# EAGLE design fms controller (EAGLE 9.0.1)
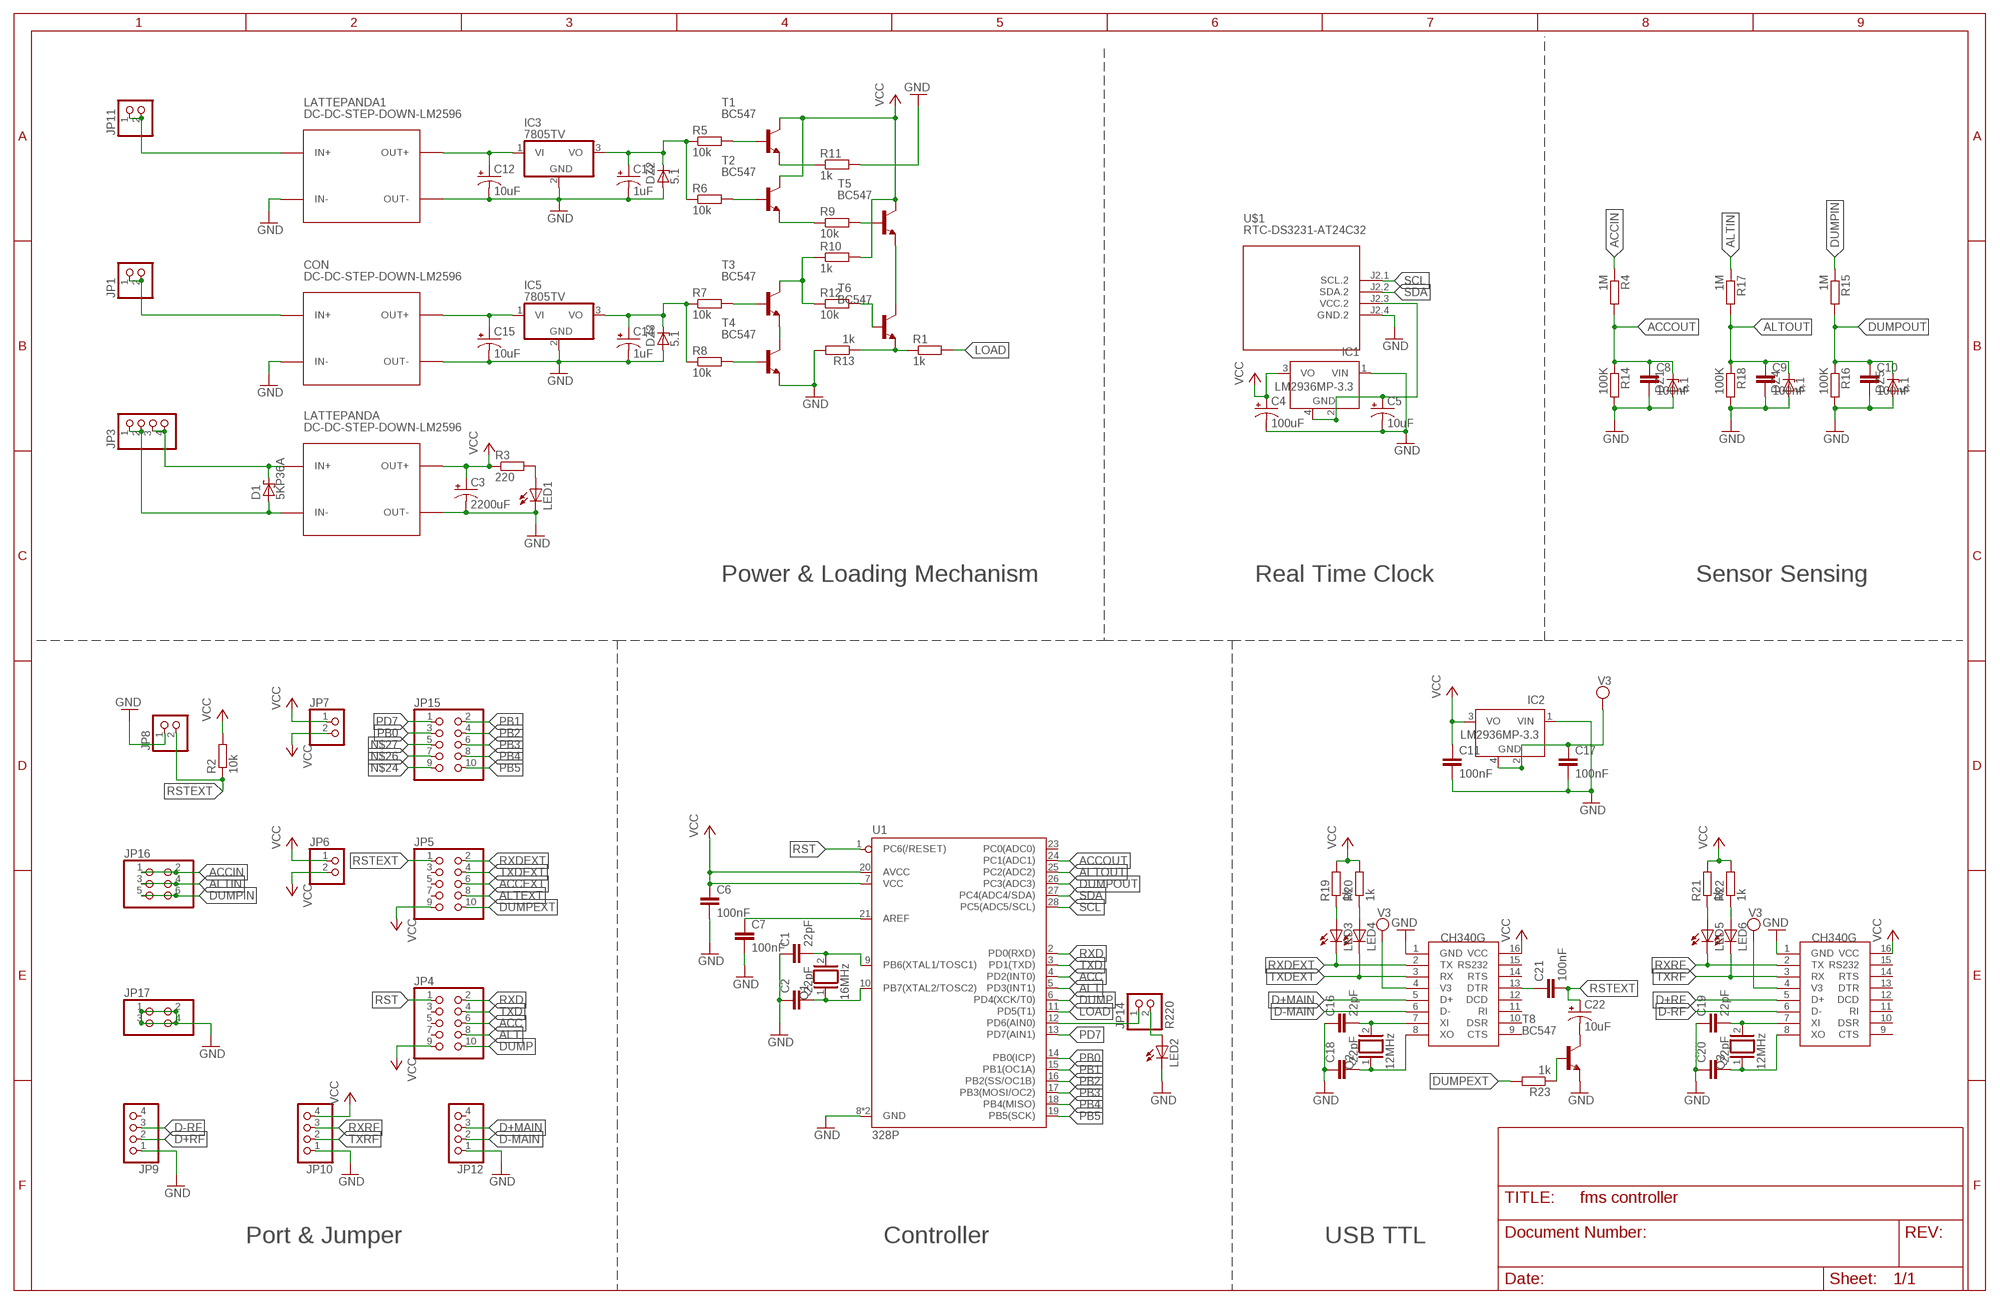
[diagram p0: schematic, sheet 1]

## Parts
C1  22pF  C2,5-3  [C2.5-3]
C2  22pF  C2,5-3  [C2.5-3]
C3  2200uF  CPOL-USE5-13  [E5-13]
C4  100uF  CPOL-USE2-5  [E2-5]
C5  10uF  CPOL-USE2-5  [E2-5]
C6  100nF  C-EU025-040X050  [C025-040X050]
C7  100nF  C-EU025-040X050  [C025-040X050]
C8  100nF  C-EU025-040X050  [C025-040X050]
C9  100nF  C-EU025-040X050  [C025-040X050]
C10  100nF  C-EU025-040X050  [C025-040X050]
C11  100nF  C-EU025-040X050  [C025-040X050]
C12  10uF  CPOL-USE2-5  [E2-5]
C13  1uF  CPOL-USE2-5  [E2-5]
C14  1uF  CPOL-USE2-5  [E2-5]
C15  10uF  CPOL-USE2-5  [E2-5]
C16  22pF  C2,5-3  [C2.5-3]
C17  100nF  C-EU025-040X050  [C025-040X050]
C18  22pF  C2,5-3  [C2.5-3]
C19  22pF  C2,5-3  [C2.5-3]
C20  22pF  C2,5-3  [C2.5-3]
C21  100nF  C-EU025-040X050  [C025-040X050]
C22  10uF  CPOL-USE2-5  [E2-5]
CON  DC-DC-STEP-DOWN-LM2596  [DC-DC-STEP-DOWN-LM2596]
D1  5KP36A  5KPXX  [P6T15]
DZ1  5.1  ZPD  [DO35Z10]
DZ2  5.1  ZPD  [DO35Z10]
DZ3  5.1  ZPD  [DO35Z10]
DZ4  5.1  ZPD  [DO35Z10]
DZ5  5.1  ZPD  [DO35Z10]
IC1  LM2936MP-3.3  [SOT223]
IC2  LM2936MP-3.3  [SOT223]
IC3  7805TV  [TO220V]
IC5  7805TV  [TO220V]
JP1  PINHD-1X2  [1X02]
JP3  PINHD-1X4  [1X04]
JP4  PINHD-2X5  [2X05]
JP5  PINHD-2X5  [2X05]
JP6  PINHD-1X2  [1X02]
JP7  PINHD-1X2  [1X02]
JP8  PINHD-1X2  [1X02]
JP9  PINHD-1X4  [1X04]
JP10  PINHD-1X4  [1X04]
JP11  PINHD-1X2  [1X02]
JP12  PINHD-1X4  [1X04]
JP14  R220  PINHD-1X2  [1X02]
JP15  PINHD-2X5  [2X05]
JP16  PINHD-2X3  [2X03]
JP17  PINHD-2X2  [2X02]
LATTEPANDA  DC-DC-STEP-DOWN-LM2596  [DC-DC-STEP-DOWN-LM2596]
LATTEPANDA1  DC-DC-STEP-DOWN-LM2596  [DC-DC-STEP-DOWN-LM2596]
LED1  LED3MM  [LED3MM]
LED2  LED3MM  [LED3MM]
LED3  LED3MM  [LED3MM]
LED4  LED3MM  [LED3MM]
LED5  LED3MM  [LED3MM]
LED6  LED3MM  [LED3MM]
Q1  16MHz  XTAL/S  [QS]
Q2  12MHz  XTAL/S  [QS]
Q3  12MHz  XTAL/S  [QS]
R1  1k  R-EU_0309/10  [0309/10]
R2  10k  R-EU_0309/10  [0309/10]
R3  220  R-EU_0309/10  [0309/10]
R4  1M  R-EU_0309/10  [0309/10]
R5  10k  R-EU_0309/10  [0309/10]
R6  10k  R-EU_0309/10  [0309/10]
R7  10k  R-EU_0309/10  [0309/10]
R8  10k  R-EU_0309/10  [0309/10]
R9  10k  R-EU_0309/10  [0309/10]
R10  1k  R-EU_0309/10  [0309/10]
R11  1k  R-EU_0309/10  [0309/10]
R12  10k  R-EU_0309/10  [0309/10]
R13  1k  R-EU_0309/10  [0309/10]
R14  100K  R-EU_0309/10  [0309/10]
R15  1M  R-EU_0309/10  [0309/10]
R16  100K  R-EU_0309/10  [0309/10]
R17  1M  R-EU_0309/10  [0309/10]
R18  100K  R-EU_0309/10  [0309/10]
R19  1k  R-EU_0309/10  [0309/10]
R20  1k  R-EU_0309/10  [0309/10]
R21  1k  R-EU_0309/10  [0309/10]
R22  1k  R-EU_0309/10  [0309/10]
R23  1k  R-EU_0309/10  [0309/10]
T1  BC547  [TO92]
T2  BC547  [TO92]
T3  BC547  [TO92]
T4  BC547  [TO92]
T5  BC547  [TO92]
T6  BC547  [TO92]
T8  BC547  [TO92]
U1  328P  ATMEGA328P_PDIP  [DIP28]
U$1  RTC-DS3231-AT24C32  [RTC-DS3231-AT24C32]
U$2  CH340G  [SOIC16]
U$3  CH340G  [SOIC16]

## Nets
ACC: JP4.6 U1.4(PD2(INT0))
ACCEXT: JP5.6
ACCIN: JP16.1 JP16.2 R4.1
ACCOUT: C8.1 DZ1.C R4.2 R14.1 U1.24(PC1(ADC1))
ALT: JP4.8 U1.5(PD3(INT1))
ALTEXT: JP5.8
ALTIN: JP16.3 JP16.4 R17.1
ALTOUT: C9.1 DZ4.C R17.2 R18.1 U1.25(PC2(ADC2))
D+MAIN: JP12.3 U$2.5(D+)
D+RF: JP9.2 U$3.5(D+)
D-MAIN: JP12.2 U$2.6(D-)
D-RF: JP9.3 U$3.6(D-)
DUMP: JP4.10 U1.6(PD4(XCK/T0))
DUMPEXT: JP5.10 R23.2
DUMPIN: JP16.5 JP16.6 R15.1
DUMPOUT: C10.1 DZ5.C R15.2 R16.1 U1.26(PC3(ADC3))
GND: C1.1 C2.1 C3.- C4.- C5.- C6.2 C7.2 C8.2 C9.2 C10.2 C11.2 C12.- C13.- C14.- C15.- C16.1 C17.2 C18.1 C19.1 C20.1 CON.IN- CON.OUT- DZ1.A DZ2.A DZ3.A DZ4.A DZ5.A IC1.1(VIN) IC2.1(VIN) IC3.2(GND) IC5.2(GND) JP8.1 JP9.1 JP10.1 JP12.1 JP17.1 JP17.2 JP17.3 JP17.4 LATTEPANDA1.IN- LATTEPANDA1.OUT- LATTEPANDA.OUT- LED1.K(C) LED2.K(C) R11.2 R13.2 R14.2 R16.2 R18.2 T4.1(E) T8.1(E) U1.8(GND) U1.22(GND) U$1.J2.4(GND.2) U$2.1(GND) U$3.1(GND)
LOAD: R1.2 U1.11(PD5(T1))
N$1: JP11.1 JP11.2 LATTEPANDA1.IN+
N$3: CON.IN+ JP1.1 JP1.2
N$5: LED1.A R3.2
N$7: D1.A JP3.1 JP3.2 LATTEPANDA.IN-
N$8: D1.C JP3.3 JP3.4 LATTEPANDA.IN+
N$9: C12.+ IC3.1(VI) LATTEPANDA1.OUT+
N$10: C1.2 Q1.2 U1.9(PB6(XTAL1/TOSC1))
N$11: JP14.1 U1.12(PD6(AIN0))
N$12: C13.+ DZ2.C IC3.3(VO) R5.1 R6.1
N$13: R1.1 R13.1 T6.1(E)
N$14: C15.+ CON.OUT+ IC5.1(VI)
N$15: C2.2 Q1.1 U1.10(PB7(XTAL2/TOSC2))
N$16: C14.+ DZ3.C IC5.3(VO) R7.1 R8.1
N$17: JP14.2 LED2.A
N$18: C5.+ IC1.2(GND) IC1.4(GND) U$1.J2.3(VCC.2)
N$19: C7.1 U1.21(AREF)
N$20: C19.2 Q3.2 U$3.7(XI)
N$21: R11.1 T1.1(E)
N$22: C20.2 Q3.1 U$3.8(XO)
N$23: C16.2 Q2.2 U$2.7(XI)
N$24: JP15.9
N$25: R5.2 T1.2(B)
N$26: JP15.7
N$27: JP15.5
N$28: C18.2 Q2.1 U$2.8(XO)
N$29: R10.1 R12.1 T3.3(C)
N$30: R6.2 T2.2(B)
N$31: C21.1 U$2.13(DTR)
N$32: R7.2 T3.2(B)
N$33: C22.- T8.3(C)
N$34: R9.1 T2.1(E)
N$35: R9.2 T5.2(B)
N$36: R8.2 T4.2(B)
N$37: LED4.A R20.1
N$38: T3.1(E) T4.3(C)
N$39: LED3.A R19.1
N$40: R12.2 T6.2(B)
N$41: T5.1(E) T6.3(C)
N$42: LED5.A R21.1
N$43: LED6.A R22.1
N$44: R23.1 T8.2(B)
PB0: JP15.3 U1.14(PB0(ICP))
PB1: JP15.2 U1.15(PB1(OC1A))
PB2: JP15.4 U1.16(PB2(SS/OC1B))
PB3: JP15.6 U1.17(PB3(MOSI/OC2))
PB4: JP15.8 U1.18(PB4(MISO))
PB5: JP15.10 U1.19(PB5(SCK))
PD7: JP15.1 U1.13(PD7(AIN1))
RST: JP4.1 U1.1(PC6(/RESET))
RSTEXT: C21.2 C22.+ JP5.1 JP8.2 R2.1
RXD: JP4.2 U1.2(PD0(RXD))
RXDEXT: JP5.2 LED3.K(C) U$2.2(TX)
RXRF: JP10.3 LED5.K(C) U$3.2(TX)
SCL: U1.28(PC5(ADC5/SCL)) U$1.J2.1(SCL.2)
SDA: U1.27(PC4(ADC4/SDA)) U$1.J2.2(SDA.2)
TXD: JP4.4 U1.3(PD1(TXD))
TXDEXT: JP5.4 LED4.K(C) U$2.3(RX)
TXRF: JP10.2 LED6.K(C) U$3.3(RX)
VCC: C3.+ C4.+ C6.1 C11.1 IC1.3(VO) IC2.3(VO) JP4.9 JP5.9 JP6.1 JP6.2 JP7.1 JP7.2 JP10.4 LATTEPANDA.OUT+ R2.2 R3.1 R10.2 R19.2 R20.2 R21.2 R22.2 T1.3(C) T2.3(C) T5.3(C) U1.7(VCC) U1.20(AVCC) U$2.16(VCC) U$3.16(VCC)
VSS: C17.1 IC2.2(GND) IC2.4(GND) U$2.4(V3) U$3.4(V3) ; supply symbol labelled V3
Unconnected: JP4.3 JP4.5 JP4.7 JP5.3 JP5.5 JP5.7 JP9.4 JP12.4 U1.23(PC0(ADC0)) U$2.9(CTS) U$2.10(DSR) U$2.11(RI) U$2.12(DCD) U$2.14(RTS) U$2.15(RS232) U$3.9(CTS) U$3.10(DSR) U$3.11(RI) U$3.12(DCD) U$3.13(DTR) U$3.14(RTS) U$3.15(RS232)

## Notes on the sheet
- Power & Loading Mechanism | Real Time Clock | Sensor Sensing
- Port & Jumper | Controller | USB TTL

## Library data of the parts
C1 C2 C16 C18-C20 = capacitor-wima:C: CAPACITOR naming: grid - package width
C3-C5 C12-C15 C22 = rcl:CPOL-US: POLARIZED CAPACITOR, American symbol; SPICEPREFIX: C
C6-C11 C17 C21 = rcl:C-EU: CAPACITOR, European symbol; SPICEPREFIX: C
CON LATTEPANDA LATTEPANDA1 = diy-modules:DC-DC-STEP-DOWN-LM2596: DC/DC Step-Down Regulator based on LM2596-ADJ chip LM2596 datasheet available here: http://www.ti.com/lit/ds/symlink/lm2596.pdf Click here to find device on ebay.com <http://www.ebay.com/sch/lm2596+power+regulator>
D1 = diode:5KPXX: DIODE transient voltage suppressor
DZ1-DZ5 = diode:ZPD: Z DIODE 500 mW
IC1 IC2 = national-semiconductor:LM2936MP?*: Ultra-Low Quiescent Current LDO Voltage Regulator Source: Data sheet <http://www.national.com/ds/LM/LM2936.pdf>; MF: NATIONAL SEMICONDUCTOR; MPN: LM2936MP-3.3/NOPB; OC_FARNELL: 1469062; OC_NEWARK: 41K4523
IC3 IC5 = linear:78*: Positive VOLTAGE REGULATOR Source: http://cache.national.com/ds/LM/LM78L05.pdf http://www.fairchildsemi.com/ds/LM/LM7805.pdf
JP1 JP6-JP8 JP11 JP14 = pinhead:PINHD-1X2: PIN HEADER
JP3 JP9 JP10 JP12 = pinhead:PINHD-1X4: PIN HEADER
JP4 JP5 JP15 = pinhead:PINHD-2X5: PIN HEADER
JP16 = pinhead:PINHD-2X3: PIN HEADER
JP17 = pinhead:PINHD-2X2: PIN HEADER
LED1-LED6 = led:LED: LED OSRAM: - CHIPLED LG R971, LG N971, LY N971, LG Q971, LY Q971, LO R971, LY R971 LH N974, LH R974 LS Q976, LO Q976, LY Q976 LO Q996 - Hyper CHIPLED LW Q18S LB Q993, LB Q99A, LB R99A - SideLED LS A670, LO A670, LY A670, LG A670, LP A670 LB A673, LV A673, LT A673, LW A673 LH A674 LY A675 LS A676, LA A676, LO A676, LY A676, LW A676 LS A679, LY A679, LG A679 - Hyper Micro SIDELED® LS Y876, LA Y876, LO Y876, LY Y876 LT Y87S - SmartLED LW L88C, LW L88S LB L89C, LB L89S, LG L890 LS L89K, LO L89K, LY L89K LS L896, LA L896, LO L896, LY L896 - TOPLED LS T670, LO T670, LY T670, LG T670, LP T670 LSG T670, LSP T670, LSY T670, LOP T670, LYG T670 LG T671, LOG T671, LSG T671 LB T673, LV T673, LT T673, LW T673 LH T674 LS T676, LA T676, LO T676, LY T676, LB T676, LH T676, LSB T676, LW T676 LB T67C, LV T67C, LT T67C, LS T67K, LO T67K, LY T67K, LW E67C LS E67B, LA E67B, LO E67B, LY E67B, LB E67C, LV E67C, LT E67C LW T67C LS T679, LY T679, LG T679 LS T770, LO T770, LY T770, LG T770, LP T770 LB T773, LV T773, LT T773, LW T773 LH T774 LS E675, LA E675, LY E675, LS T675 LS T776, LA T776, LO T776, LY T776, LB T776 LHGB T686 LT T68C, LB T68C - Hyper Mini TOPLED® LB M676 - Mini TOPLED Santana® LG M470 LS M47K, LO M47K, LY M47K Source: http://www.osram.convergy.de LUXEON: - LUMILED® LXK2-PW12-R00, LXK2-PW12-S00, LXK2-PW14-U00, LXK2-PW14-V00 LXK2-PM12-R00, LXK2-PM12-S00, LXK2-PM14-U00 LXK2-PE12-Q00, LXK2-PE12-R00, LXK2-PE12-S00, LXK2-PE14-T00, LXK2-PE14-U00 LXK2-PB12-K00, LXK2-PB12-L00, LXK2-PB12-M00, LXK2-PB14-N00, LXK2-PB14-P00, LXK2-PB14-Q00 LXK2-PR12-L00, LXK2-PR12-M00, LXK2-PR14-Q00, LXK2-PR14-R00 LXK2-PD12-Q00, LXK2-PD12-R00, LXK2-PD12-S00 LXK2-PH12-R00, LXK2-PH12-S00 LXK2-PL12-P00, LXK2-PL12-Q00, LXK2-PL12-R00 Source: www.luxeon.com KINGBRIGHT: KA-3528ASYC Source: www.kingbright.com
Q1-Q3 = special:XTAL/S: CRYSTAL
R1-R23 = rcl:R-EU_: RESISTOR, European symbol; SPICEPREFIX: R
T1-T6 T8 = transistor:BC547: NPN TRANSISTOR
U1 = SparkFun-IC-Microcontroller:ATMEGA328P_PDIP: Atmel 328P Through hole ATMEGA328P uC used in the Arduino 32kb flash, 1k EEPROM, 2k SRAM Datasheet <http://www.sparkfun.com/datasheets/Components/SMD/ATMega328.pdf> SparkFun Products Storefront component: AVR 28 Pin 20MHz 32K 6A/D - ATMega328P <https://www.sparkfun.com/products/9061> (COM-09061) SparkFun Simon Says - Through-Hole Soldering Kit <https://www.sparkfun.com/products/10547> (KIT-10547) SparkFun Learn to Solder - Simon Says <https://www.sparkfun.com/products/13708> (KIT-13708) SparkFun BigTime Watch Kit <https://www.sparkfun.com/products/11734> (KIT-11734) SparkFun ClockIt <https://www.sparkfun.com/products/10930> (KIT-10930) SparkFun Serial Enabled LCD Kit <https://www.sparkfun.com/products/10097> (LCD-10097) SparkFun Simon Tilts - Through Hole Soldering Kit <https://www.sparkfun.com/products/12634> (KIT-12634) SparkFun Frequency Counter Kit <https://www.sparkfun.com/products/10140> (KIT-10140) FabFM Radio Kit <https://www.sparkfun.com/products/11043> (KIT-11043) SparkFun Binary Blaster Kit <https://www.sparkfun.com/products/12037> (KIT-12037) SparkFun Metro-Gnome <https://www.sparkfun.com/products/9236> (KIT-09236) ATmega328 with Arduino Optiboot (Uno) <https://www.sparkfun.com/products/10524> (DEV-10524); PROD_ID: IC-09136
U$1 = diy-modules:RTC-DS3231-AT24C32: RTC Module with Battery and EEPROM based on DS3231 and AT24C32 chips Tutorial can be found here: https://edwardmallon.wordpress.com/2014/05/21/using-a-cheap-3-ds3231-rtc-at24c32-eeprom-from-ebay/ Click here to find device on ebay.com <http://www.ebay.com/sch/DS3231+AT24C32+module>
U$2 U$3 = ch340g:CH340G

## Board
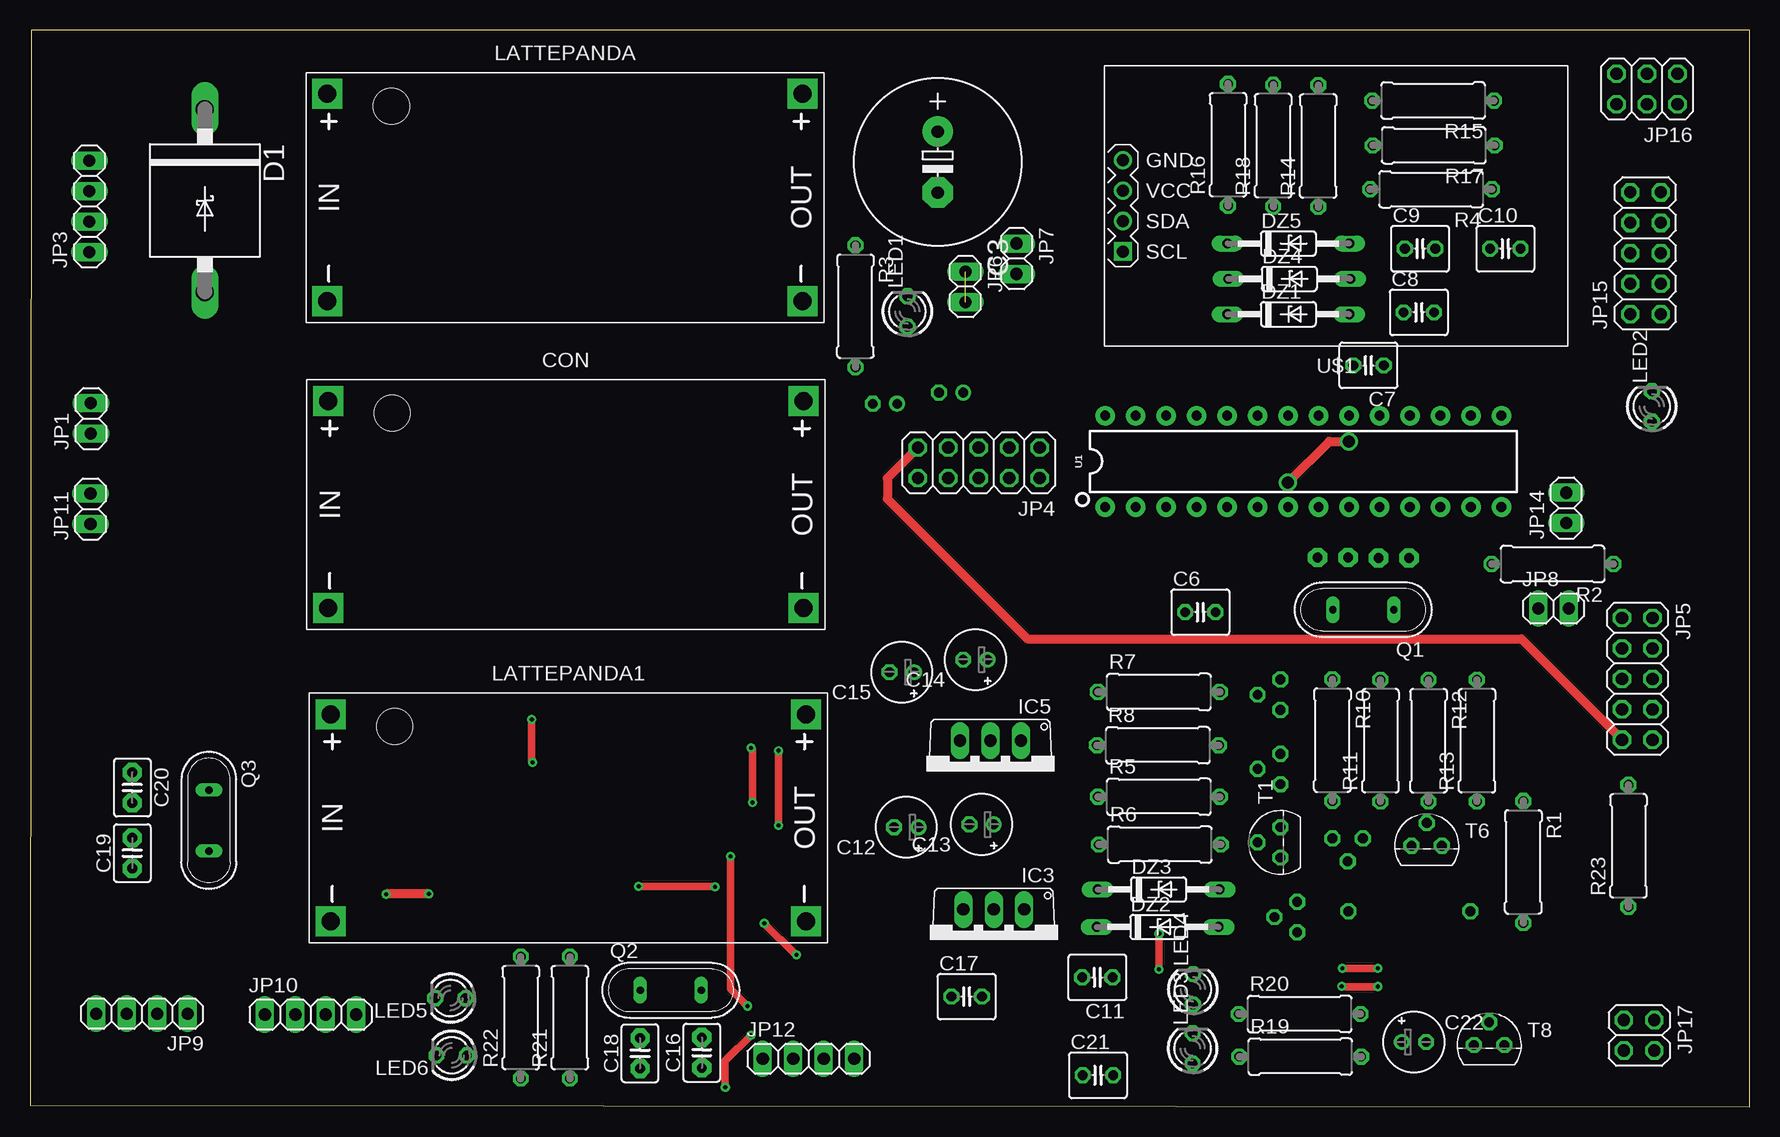
[diagram p1: board, top side]
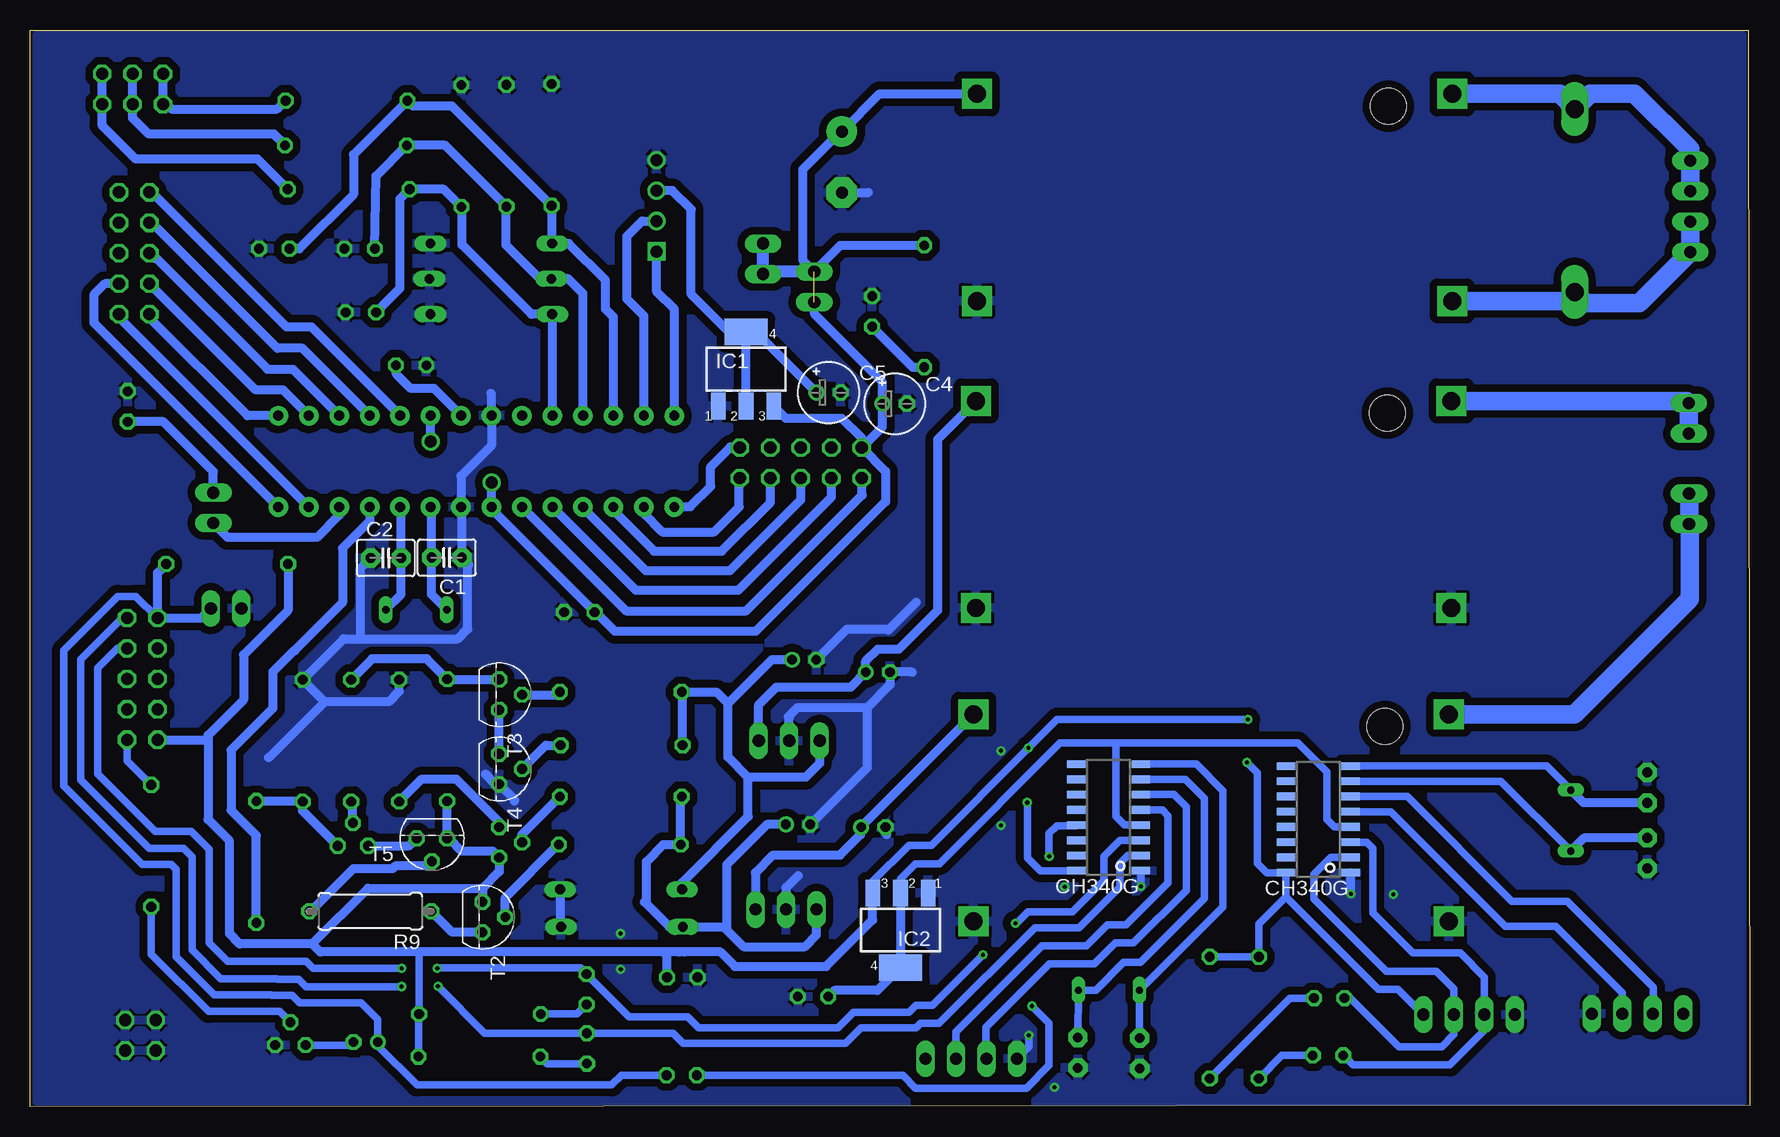
[diagram p2: board, bottom side, seen from below]

Size 143.34 x 89.78 mm. Coordinates in mm from the lower left corner, seen from the top.
Outline: 0,0.13 143.34,0 143.34,89.75 0.1,89.78 0,0.13
Copper layers (1*16): Top 0.035mm / dielectric 1.5mm / Bottom 0.035mm
Design rules "default *": minimum track width 30mil, minimum drill 1mm, track to track 8mil, track to pad 8mil, pad to pad 8mil, via to via 8mil, smd to smd 8mil, copper to edge 0mil, drill to drill 10mil, minimum pad ring 10mil, minimum via ring 8mil, stop-mask expansion 4mil, vias tented up to drill 0mil, thermal gap 10mil

### Footprints (pad centres in the part's own frame; a part is rotated, then mirrored left to right if it is on the bottom)
C2.5-3 = drill 0.813 pad 1.6 octagon: 1 -1.27,0; 2 1.27,0
E5-13 = drill 1.016 pad 2.54: + -2.54,0 | drill 1.016 pad 2.54 octagon: - 2.54,0
E2-5 = drill 0.813 pad 1.27: + -1.016,0 | drill 0.813 pad 1.27 octagon: - 1.016,0
C025-040X050 = drill 0.813 octagon: 1 -1.27,0; 2 1.27,0
DC-DC-STEP-DOWN-LM2596 = drill 1.5 pad 2.5 square: IN+ -19.812,8.636; IN- -19.812,-8.636; OUT+ 19.812,8.636; OUT- 19.812,-8.636 | hole 3: -14.478,7.62
P6T15 = drill 1.499 long: A 7.62,0; C -7.62,0
DO35Z10 = drill 0.813 long: A 5.08,0; C -5.08,0
SOT223 = smd 1.219 x 2.235: 1 -2.311,-3.099; 2 0,-3.099; 3 2.311,-3.099 | smd 3.6 x 2.2: 4 0,3.099
TO220V = drill 1.016 long: 1 -2.54,-2.54; 2 0,-2.54; 3 2.54,-2.54
1X02 = drill 1.016 long: 1 -1.27,0; 2 1.27,0
1X04 = drill 1.016 long: 1 -3.81,0; 2 -1.27,0; 3 1.27,0; 4 3.81,0
2X05 = drill 1.016 octagon: 1 -5.08,-1.27; 2 -5.08,1.27; 3 -2.54,-1.27; 4 -2.54,1.27; 5 0,-1.27; 6 0,1.27; 7 2.54,-1.27; 8 2.54,1.27; 9 5.08,-1.27; 10 5.08,1.27
2X03 = drill 1.016 octagon: 1 -2.54,-1.27; 2 -2.54,1.27; 3 0,-1.27; 4 0,1.27; 5 2.54,-1.27; 6 2.54,1.27
2X02 = drill 1.016 octagon: 1 -1.27,-1.27; 2 -1.27,1.27; 3 1.27,-1.27; 4 1.27,1.27
LED3MM = drill 0.813 octagon: A -1.27,0; K 1.27,0
QS = drill 0.61 long: 1 -2.54,0; 2 2.54,0
0309/10 = drill 0.813 octagon: 1 -5.08,0; 2 5.08,0
TO92 = drill 0.813 octagon: 1 1.27,0; 2 0,1.905; 3 -1.27,0
DIP28 = drill 0.813 pad 1.626: 1 -16.51,-3.81; 2 -13.97,-3.81; 3 -11.43,-3.81; 4 -8.89,-3.81; 5 -6.35,-3.81; 6 -3.81,-3.81; 7 -1.27,-3.81; 8 1.27,-3.81; 9 3.81,-3.81; 10 6.35,-3.81; 11 8.89,-3.81; 12 11.43,-3.81; 13 13.97,-3.81; 14 16.51,-3.81; 15 16.51,3.81; 16 13.97,3.81; 17 11.43,3.81; 18 8.89,3.81; 19 6.35,3.81; 20 3.81,3.81; 21 1.27,3.81; 22 -1.27,3.81; 23 -3.81,3.81; 24 -6.35,3.81; 25 -8.89,3.81; 26 -11.43,3.81; 27 -13.97,3.81; 28 -16.51,3.81
RTC-DS3231-AT24C32 = drill 1 square: J2.1 17.78,3.81 | drill 1: J2.2 17.78,1.27; J2.3 17.78,-1.27; J2.4 17.78,-3.81
SOIC16 = smd 0.635 x 1.524: 1 -4.445,-2.695; 2 -3.175,-2.695; 3 -1.905,-2.695; 4 -0.635,-2.695; 5 0.635,-2.695; 6 1.905,-2.695; 7 3.175,-2.695; 8 4.445,-2.695; 9 4.445,2.695; 10 3.175,2.695; 11 1.905,2.695; 12 0.635,2.695; 13 -0.635,2.695; 14 -1.905,2.695; 15 -3.175,2.695; 16 -4.445,2.695

### Placement (x,y rotation side)
C1  108.6,45.79 180 bottom
C2  113.68,45.76 0 bottom
C3  75.66,78.76 270 top
C4  71.27,58.62 0 bottom
C5  76.78,59.56 0 bottom
C6  97.56,41.24 0 top
C7  111.58,61.82 180 top
C8  115.77,66.24 0 top
C9  115.87,71.54 0 top
C10  122.98,71.54 0 top
C11  88.97,10.79 180 top
C12  73.04,23.31 180 top
C13  79.32,23.54 180 top
C14  78.81,37.28 180 top
C15  72.66,36.24 180 top
C16  56,4.51 90 top
C17  78.07,9.19 0 top
C18  50.84,4.46 90 top
C19  8.53,21.15 90 top
C20  8.53,26.61 270 top
C21  89.02,2.63 0 top
C22  115.36,5.4 0 top
CON  44.67,50.21 0 top
D1  14.57,75.56 270 top
DZ1  104.9,66.08 0 top
DZ2  94,15 0 top
DZ3  94.08,18.13 0 top
DZ4  104.97,69.03 0 top
DZ5  104.9,71.98 0 top
IC1  83.66,61.51 0 bottom
IC2  70.78,14.72 180 bottom
IC3  80.33,13.91 180 top
IC5  80.05,27.98 180 top
JP1  5.07,57.4 90 top
JP3  4.95,75.08 90 top
JP4  79.09,53.69 180 top
JP5  133.98,35.68 270 top
JP6  77.97,68.37 270 top
JP7  82.24,70.71 270 top
JP8  126.99,41.55 0 top
JP9  9.34,7.76 180 top
JP10  23.39,7.69 0 top
JP11  5.05,49.85 90 top
JP12  64.89,4.01 0 top
JP14  128.06,49.93 90 top
JP15  134.66,71.16 90 top
JP16  134.79,84.85 180 top
JP17  134.13,5.96 270 top
LATTEPANDA  44.6,75.81 0 top
LATTEPANDA1  44.88,24.1 0 top
LED1  73.15,66.31 90 top
LED2  135.2,58.39 90 top
LED3  96.92,4.87 90 top
LED4  96.95,9.8 90 top
LED5  35.05,9.06 180 top
LED6  35.15,4.29 180 top
Q1  111.14,41.45 180 top
Q2  53.41,9.72 0 top
Q3  14.9,23.87 270 top
R1  124.48,20.41 270 top
R2  126.92,45.26 180 top
R3  68.8,66.74 270 top
R4  116.78,76.5 180 top
R5  94.1,25.85 0 top
R6  94.18,21.86 0 top
R7  94.1,34.59 0 top
R8  94.02,30.14 0 top
R9  114.98,16.3 180 bottom
R10  108.56,30.57 270 top
R11  112.57,30.52 90 top
R12  116.58,30.52 270 top
R13  120.62,30.52 90 top
R14  107.39,80.1 90 top
R15  116.96,83.89 180 top
R16  99.87,80.21 90 top
R17  117.01,80.16 180 top
R18  103.63,80.13 90 top
R19  105.89,4.18 0 top
R20  105.84,7.74 0 top
R21  45,7.43 90 top
R22  40.91,7.43 90 top
R23  133.24,21.76 90 top
T1  104.24,22.04 90 top
T2  105.63,15.82 270 bottom
T3  104.24,34.36 270 bottom
T4  104.24,28.16 270 bottom
T5  109.84,22.37 180 bottom
T6  116.43,21.76 0 top
T8  121.63,5.15 0 top
U1  106.14,53.82 0 top
U$1  108.88,75.13 180 top
U$2  53.44,24.12 90 bottom
U$3  35.96,23.97 90 bottom

### Tracks (layer width: path | path; a pad name or v marks a point on that pad's centre or on a via)
ACC
  Bottom 0.762: U1.4 97.25,49.93 92.02,44.7 85.01,44.7 79.09,50.61 JP4.6
ACCIN
  Bottom 0.762: JP16.1 JP16.2 137.33,81.88 137.36,81.86 134.51,79.01 124.38,79.01 R4.1
ACCOUT
  Bottom 0.762: U1.24 99.79,65.45 DZ1.C 101.54,66.08 107.33,71.87 107.33,74.97 107.28,75.02 R14.1 108.86,76.5 R4.2 112.49,75.71 112.49,68.24 C8.1
ALT
  Bottom 0.762: U1.5 92.86,43.07 84.3,43.07 76.55,50.82 JP4.8
ALTIN
  Bottom 0.762: JP16.3 JP16.4 134.79,82.44 133.45,81.09 123.03,81.09 R17.1
ALTOUT
  Bottom 0.762: C9.1 114.5,77.59 R17.2 108.73,80.15 R18.1 103.6,75.02 103.68,74.95 103.68,71.85 100.86,69.03 DZ4.C 98.47,69.03 97.25,67.81 U1.25
D+MAIN
  Bottom 0.635: U$2.5 48.97,24.76 48.48,24.27 48.48,18.69 51.99,15.18 53.51,15.18 55.29,13.4 59,13.4 66.16,6.24 JP12.3
D+RF
  Bottom 0.635: U$3.5 29.92,24.6 20.36,15.05 16.17,15.05 10.61,9.49 JP9.2
D-MAIN
  Bottom 0.635: U$2.6 48,26.03 46.96,24.99 46.96,18.05 51.35,13.66 52.85,13.66 54.6,11.9 58.36,11.9 63.65,6.62 63.65,4.03 JP12.2
D-RF
  Bottom 0.635: JP9.3 8.02,7.82 8.02,9.97 15.18,17.14 19.81,17.14 28.54,25.87 U$3.6
DUMP
  Bottom 0.762: U1.6 93.67,41.34 83.64,41.34 73.98,51 73.98,52.39 JP4.10
DUMPEXT
  Bottom 0.635: R23.2 135.25,28.85 JP5.10
DUMPIN
  Bottom 0.762: JP16.5 JP16.6 131.95,83.58 131.54,83.18 122.75,83.18 R15.1
DUMPOUT
  Bottom 0.762: U1.26 94.71,65.85 95.37,66.51 95.37,68.9 98.44,71.98 DZ5.C 99.82,75.07 R16.1 108.17,83.43 111.42,83.43 R15.2 116.38,79.39 116.38,76.07 120.9,71.54 C10.1
GND  (via drill 0.35)
  Top 0.635: v50.74,18.38 57.04,18.38 v57.09,18.33 | v62.4,23.46 v62.4,29.68 | v60.09,5.96 57.96,3.83 v57.96,1.62 | v94.1,11.47 94.1,14.42 v94.13,14.44
  Top 0.762: v33.24,17.75 29.71,17.75 v29.69,17.72
  Bottom 0.635: U$2.1 v50.74,18.38 | JP12.1 60.09,5 v60.09,5.96
  Bottom 0.762: C3.- 73.45,76.22 | 71.93,22.7 C12.- | 79.32,19.27 80.33,18.25 IC3.2 | 69.82,36.24 C15.- 71.65,35.2 73.55,33.29 | IC5.2 80.06,32.45 80.13,32.53 79.37,33.29 73.55,33.29 | CON.OUT- 63.6,41.57 | C13.- 73.55,28.29 73.55,33.29 | C14.- 75.25,39.82 71.88,39.82 71.8,39.74 69.46,42.08 | DZ3.A 99.16,15.08 DZ2.A | R11.2 112.57,34.66 113.46,33.77 118.79,33.77 | 118.79,33.77 R13.2 117.22,39.01 115.74,39.01 | 123.46,29.1 118.79,33.77 | C2.1 115.82,44.9 115.82,39.08 115.74,39.01 | 115.74,39.01 107.67,39.01 106.85,39.82 106.85,45.1 106.75,45.2 C1.1 107.33,49.93 U1.8 107.41,52.6 104.87,55.14 U1.22 104.87,59.43 104.95,59.5 | 102.97,25.49 102.97,25.62 T4.1 104.52,26.89 105.38,27.75 | U$3.1 33.27,17.77 v33.24,17.75
  pour Bottom (isolate 0.635): 0.6,89.32 142.79,89.32 142.79,0.5 0.6,0.5
LOAD
  Bottom 0.762: U1.11 115.03,48.84 117.29,46.58 117.29,42.03 121.28,38.04 121.33,38.04 123.11,36.26 123.11,33.22 126.59,29.74 126.59,24.73 124.48,22.62 R1.2
N$1
  Bottom 1.524: JP11.2 JP11.1 5,48.53 5,42.33 14.6,32.73 LATTEPANDA1.IN+
N$3
  Bottom 1.524: CON.IN+ 5.25,58.84 JP1.2 JP1.1
N$5
  Bottom 0.762: LED1.A 69.77,61.66 R3.2
N$7
  Bottom 1.524: JP3.2 JP3.1 9.21,67 13.63,67 D1.A 15.34,67.18 LATTEPANDA.IN-
N$8
  Bottom 1.524: JP3.3 JP3.4 4.95,79.82 9.59,84.47 13.28,84.47 D1.C 15.84,84.45 LATTEPANDA.IN+
N$9
  Bottom 0.762: LATTEPANDA1.OUT+ 74.11,23.31 | 74.11,23.31 C12.+ | IC3.1 82.87,19.52 81.4,21 75.81,21 74.11,22.7 74.11,23.31
N$10
  Bottom 0.762: Q1.2 109.87,42.72 C1.2 109.87,49.93 U1.9
N$11
  Bottom 0.762: U1.12 117.57,49.32 119.42,47.46 126.87,47.46 JP14.1
N$12
  Bottom 0.762: C13.+ 81.91,23.54 85.26,20.19 85.26,14.75 | 85.26,14.75 83.87,13.35 78.76,13.35 77.79,14.32 IC3.3 | 85.26,14.75 85.52,15 DZ2.C 90.04,15 92.12,17.09 91.97,17.24 91.97,20.44 90.55,21.86 R6.1 89.1,25.77 R5.1
N$13
  Bottom 0.762: T6.1 120.62,24.68 R13.1 120.67,25.49 R1.1
N$14
  Bottom 0.762: CON.OUT+ 67.69,55.64 67.69,41.39 70.91,38.17 72.66,38.17 73.68,37.15 C15.+ 74.92,34.99 81.12,34.99 82.59,33.52 IC5.1
N$15
  Bottom 0.762: Q1.1 112.41,42.72 C2.2 112.41,49.93 U1.10
N$16
  Bottom 0.762: IC5.3 77.52,28.64 78.68,27.48 83.48,27.48 | 83.48,27.48 85.16,29.15 85.16,33.62 | 85.16,33.62 81.5,37.28 C14.+ | DZ3.C 89,18.69 83.48,24.2 83.48,27.48 | 85.16,33.62 86.12,34.59 R7.1 88.95,34.51 R8.1
N$17
  Bottom 0.762: JP14.2 128.06,52.95 132.23,57.12 LED2.A
N$18
  Bottom 0.762: C5.+ 82.85,64.61 IC1.4 | IC1.2 IC1.4 | IC1.4 85.11,64.61 88.23,67.73 88.23,74.82 89.81,76.4 U$1.J2.3
N$19
  Bottom 0.762: C7.1 112.82,61.79 112.82,61.1 111.6,59.89 109.67,59.89 U1.21
N$20
  Bottom 0.635: U$3.7 25.42,27.14 25.04,27.14 20.72,27.14 Q3.2
  Bottom 0.762: C19.2 13.81,22.42 Q3.2
N$21
  Bottom 0.762: R11.1 110.69,27.32 107.82,27.32 104.24,23.74 T1.1
N$22
  Bottom 0.635: Q3.1 16.91,28.41 U$3.8
  Bottom 0.762: C20.2 13.84,25.34 Q3.1
N$23
  Bottom 0.635: U$2.7 47.04,27.3 45.44,25.7 45.44,17.39 50.79,12.03 52.19,12.03 54.5,9.72 Q2.2 C16.2
N$25
  Bottom 0.762: T1.2 102.33,22.7 R5.2
N$28
  Bottom 0.635: U$2.8 46.12,28.57 43.91,26.36 43.91,16.68 Q2.1 C18.2
N$29
  Bottom 0.762: T3.3 104.26,35.65 R10.1 110.27,37.36 114.83,37.36 R12.1
N$30
  Bottom 0.762: T2.2 103.73,17.44 99.31,21.86 R6.2
N$31  (via drill 0.35)
  Top 0.635: v58.39,20.87 58.39,9.82 v59.81,8.4
  Bottom 0.635: U$2.13 56.18,23.44 57.75,23.44 58.39,22.8 v58.39,20.87 | C21.1 70.58,2.63 69.51,1.57 60.29,1.57 58.39,3.47 58.39,6.98 v59.81,8.4
N$32
  Bottom 0.762: T3.2 99.41,34.36 R7.2
N$33
  Bottom 0.635: C22.- 116.63,5.15 T8.3
N$34
  Bottom 0.762: T2.1 108.15,14.55 R9.1
N$35
  Bottom 0.762: T5.2 110.22,20.08 112.9,20.08 113.13,19.86 116.4,19.86 119.96,16.3 R9.2
N$36
  Bottom 0.762: T4.2 100.35,30.14 R8.2
N$37
  Bottom 0.635: LED4.A 97.73,7.74 R20.1
N$38
  Bottom 0.762: T4.3 T3.1
N$39
  Bottom 0.635: LED3.A 100.22,3.6 R19.1
N$40
  Bottom 0.762: T6.2 116.43,25.29 R12.2
N$41
  Bottom 0.762: 111.16,22.42 T5.1 111.72,21.76 T6.3
N$42
  Bottom 0.635: LED5.A 38.32,9.06 45,2.38 R21.1
N$43
  Bottom 0.635: LED6.A 38.98,4.28 R22.1
N$44
  Bottom 0.635: T8.2 122.52,7.94 128.47,7.94 133.24,12.72 R23.1
PB0
  Bottom 0.762: U1.14 138.02,65.37 138.02,67.71 137.1,68.62 JP15.3
PB1
  Bottom 0.762: U1.15 125.22,57.62 133.39,65.8 JP15.2
PB2
  Bottom 0.762: U1.16 122.24,59.76 124.53,59.76 JP15.4
PB3
  Bottom 0.762: JP15.6 132.96,70.73 132.78,70.73 123.54,61.49 121.43,61.49 U1.17
PB4
  Bottom 0.762: JP15.8 133.19,73.7 122.73,63.24 120.64,63.24 U1.18
PB5
  Bottom 0.762: U1.19 119.88,65.02 121.97,65.02 133.19,76.24 JP15.10
PD7
  Bottom 0.762: JP15.1 135.94,65.83 U1.13
RST
  Bottom 0.762: JP4.1 84.22,55.01 84.96,55.01 86.61,53.36 86.61,51.73 88.31,50.03 89.61,50.03 U1.1
RSTEXT
  Bottom 0.635: JP5.1 134.51,42.56 136.04,42.56 140.53,38.07 140.53,26.76 133.98,20.21 131.57,20.21 131.16,19.8 131.16,12.51 127.98,9.34 123.23,9.34 123.18,9.29 121.48,9.29 120.87,8.68 115.74,8.68 114.34,7.28 C22.+ 114.34,5.07 111.09,1.82 94.86,1.82 94.05,2.63 C21.2
  Bottom 0.762: 131.97,45.26 R2.1 | 131.97,45.26 132.71,44.52 JP5.1 129.05,40.76 JP8.2 | 131.97,45.53 131.97,45.26
RXD
  Bottom 0.762: U1.2 92.17,49.45 90.65,47.92 86.3,47.92 84.22,50 84.22,52.37 JP4.2
RXDEXT  (via drill 0.35)
  Top 0.635: v109.34,10.05 109.37,10.03 v112.36,10.03
  Bottom 0.635: U$2.2 51.81,20.95 52.47,20.29 52.47,18.36 55.9,14.93 59.58,14.93 67.56,6.95 69.11,6.95 69.49,6.57 74.09,6.57 75.36,5.3 88.92,5.3 89.76,6.14 LED3.K 105.43,6.14 v109.34,10.05 | v112.36,10.03 120.34,10.03 120.95,10.63 122.7,10.63 122.75,10.69 127.45,10.69 129.84,13.07 129.84,20.85 130.55,21.56 133.42,21.56 139.13,27.27 139.13,37.28 135.66,40.76 JP5.2
RXRF
  Bottom 0.635: U$3.2 34.92,20.79 36.32,19.4 36.32,17.34 30.27,11.3 26.11,11.3 24.66,9.85 JP10.3 24.66,6.04 25.67,5.02 29.25,5.02 33.29,9.06 LED5.K
SCL
  Bottom 0.762: 89.5,57.75 U1.28 89.63,66.49 91.1,67.96 U$1.J2.1
SDA
  Bottom 0.762: 92.12,57.68 U1.27 92.17,65.93 93.59,67.35 93.59,72.59 92.32,73.86 U$1.J2.2
TXD
  Bottom 0.762: U1.3 94.71,49.7 91.33,46.32 85.69,46.32 81.63,50.39 JP4.4
TXDEXT  (via drill 0.35)
  Top 0.635: v61.21,15.31 63.85,12.67 v63.9,12.67 | v109.39,11.55 v112.36,11.55
  Bottom 0.635: U$2.3 52.5,22.22 53.84,20.87 53.84,18.89 56.46,16.27 60.17,16.27 61.13,15.31 v61.21,15.31 | v63.9,12.67 68.12,8.45 69.49,8.45 70.07,7.87 74.7,7.87 75.99,6.57 87.6,6.57 88.54,7.51 93.39,7.51 LED4.K 97.45,11.57 109.37,11.57 v109.39,11.55 | v112.36,11.55 119.76,11.55 120.34,12.13 126.87,12.13 128.42,13.68 128.42,21.48 129.89,22.95 132.89,22.95 137.69,27.75 137.69,36.59 136.06,38.22 JP5.4
TXRF
  Bottom 0.635: U$3.3 31.92,22.06 31.41,21.56 31.41,16.17 28.06,12.82 24.12,12.82 22.12,10.81 JP10.2 22.12,6.37 24.99,3.5 33.09,3.5 LED6.K
  Bottom 0.762: 22.55,7.82 JP10.2
VCC  (via drill 0.35, 1 pad 0.95)  (1 unrouted)
  Top 0.635: v41.83,32.3 41.83,28.8 v41.9,28.72 | v60.22,25.37 60.22,29.81 v60.12,29.91
  Top 0.762: v104.87,52.04 108.3,55.47 v109.95,55.47 | JP4.9 71.47,52.42 71.47,50.69 83.15,39.01 124.3,39.01 JP5.9
  Bottom 0.635: 41.85,32.28 v41.83,32.3 57.73,32.3 v60.12,29.91 68.22,21.81 70.07,21.81 73.09,18.79 IC2.3 | JP10.4 29.31,9.8 30.93,9.8 38.66,17.52 | 38.66,17.52 U$3.16 40.25,19.52 41.02,20.29 41.02,27.83 v41.9,28.72 | 38.66,17.52 40.91,15.26 R22.2 R21.2 | U$2.16 59.12,19.68 60.22,20.77 v60.22,25.37 | 110.87,12.87 110.92,12.92 R20.2 110.97,7.69 R19.2 | 88.79,12.9 88.82,12.92
  Bottom 0.762: LATTEPANDA.OUT+ 72.51,84.45 C3.+ 75.79,81.3 78.94,78.15 78.94,70.6 JP6.1 75.79,71.82 R3.1 | 105.63,18.23 T2.3 | 105.63,18.23 104.24,19.63 T1.3 104.77,21.3 107.36,21.3 108.43,22.37 T5.3 108.57,25.48 R10.2 | v104.87,52.04 U1.7 104.87,49.83 C6.1 96.18,41.24 94.58,39.64 82.85,39.64 72.03,50.46 72.03,52.98 JP4.9 | 105.63,18.23 115.16,18.23 119.81,13.58 | R2.2 121.84,41.39 125.55,37.69 125.55,33.93 128.49,30.98 128.49,30.6 | 119.81,13.58 125.85,13.58 126.71,14.44 126.71,22.17 128.49,23.94 128.49,30.6 | JP6.2 78.02,67.05 77.95,66.97 | 77.9,66.92 77.95,66.97 | JP4.9 72.28,56.69 C4.+ 72.28,60.42 77.95,66.08 77.95,66.97 | JP4.9 74.01,55.21 | JP4.9 74.01,55.75 75.66,57.4 80.33,57.4 IC1.3 | JP5.9 128.49,30.6 | v109.95,55.47 U1.20 | 119.81,13.58 119.14,12.92 110.92,12.92 90.57,12.92 | 89.22,12.92 88.82,12.92 85.8,12.92 84.58,11.7 76.98,11.7 73.09,15.59 IC2.3 | 89.22,12.92 90.09,12.92 | 90.09,12.92 90.57,12.92 | 90.52,12.87 90.57,12.92 | 89.25,12.9 89.22,12.92 | C11.1 90.24,12.77 90.09,12.92
  Bottom 1.016: JP6.1 82.04,69.64 JP7.2 JP7.1
VSS
  Bottom 0.635: U$3.4 34.61,23.33 35.25,23.97 35.25,27.93 37.64,30.32 52.72,30.32 | 52.72,30.32 52.83,30.22 52.83,24.2 52.12,23.49 U$2.4 | 52.72,30.32 57.47,30.32 67.53,20.26 69.54,20.26 70.78,19.02 IC2.2
  Bottom 0.762: C17.1 76.3,9.7 72.71,9.7 IC2.4 IC2.2